# EAGLE design main (EAGLE 5.10)
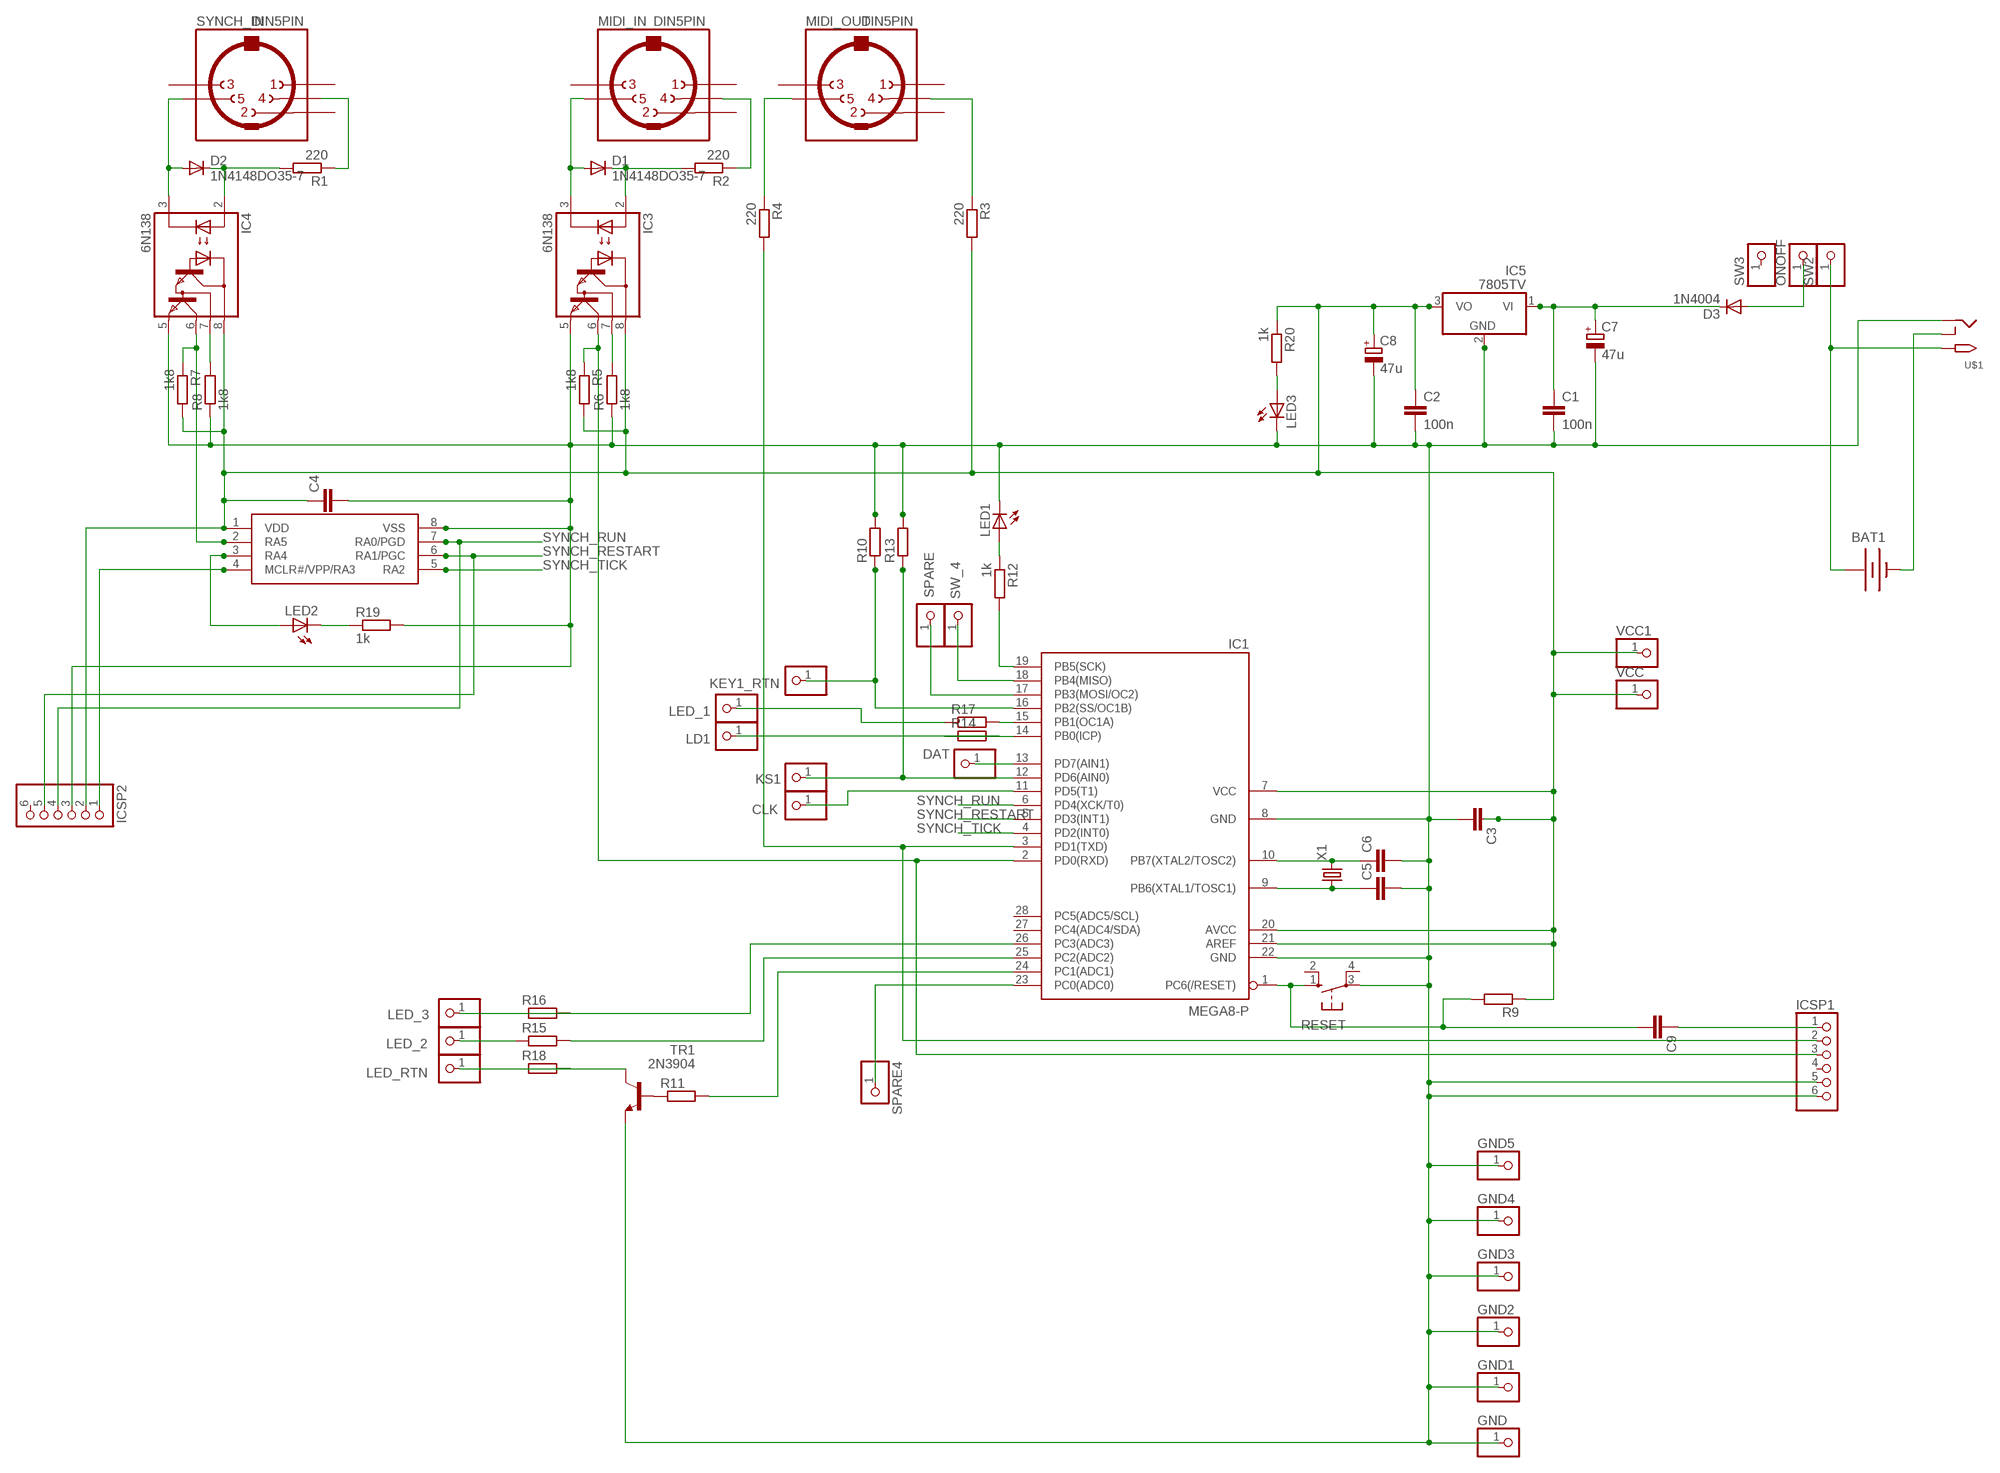
[diagram p0: schematic, sheet 1]

## Parts
BAT1  BATTERY  [PP3_BATTERBOX]
C1  100n  C-EU025-024X044  [C025-024X044]
C2  100n  C-EU025-024X044  [C025-024X044]
C3  C-EU025-024X044  [C025-024X044]
C4  C-EU025-024X044  [C025-024X044]
C5  C-EU025-024X044  [C025-024X044]
C6  C-EU025-024X044  [C025-024X044]
C7  47u  CPOL-EUE2.5-7  [E2,5-7]
C8  47u  CPOL-EUE2.5-7  [E2,5-7]
C9  C-EU025-024X044  [C025-024X044]
CLK  PINHD-1X1  [1X01]
D1  1N4148DO35-7  [DO35-7]
D2  1N4148DO35-7  [DO35-7]
D3  1N4004  [DO41-10]
DAT  PINHD-1X1  [1X01]
GND  PINHD-1X1  [1X01]
GND1  PINHD-1X1  [1X01]
GND2  PINHD-1X1  [1X01]
GND3  PINHD-1X1  [1X01]
GND4  PINHD-1X1  [1X01]
GND5  PINHD-1X1  [1X01]
IC1  MEGA8-P  [DIL28-3]
IC2  PIC12F1822  [DIL08]
IC3  6N138  [DIL08]
IC4  6N138  [DIL08]
IC5  7805TV  [TO220V]
ICSP1  PINHD-1X6  [1X06]
ICSP2  PINHD-1X6  [1X06]
KEY1_RTN  PINHD-1X1  [1X01]
KS1  PINHD-1X1  [1X01]
LD1  PINHD-1X1  [1X01]
LED1  LED3MM  [LED3MM]
LED2  LED3MM  [LED3MM]
LED3  LED3MM  [LED3MM]
LED_1  PINHD-1X1  [1X01]
LED_2  PINHD-1X1  [1X01]
LED_3  PINHD-1X1  [1X01]
LED_RTN  PINHD-1X1  [1X01]
MIDI_IN  DIN5PIN  [CHEAPYDIN]
MIDI_OUT  DIN5PIN  [CHEAPYDIN]
ONOFF  PINHD-1X1  [1X01]
R1  220  R-EU_0207/7  [0207/7]
R2  220  R-EU_0207/7  [0207/7]
R3  220  R-EU_0207/7  [0207/7]
R4  220  R-EU_0207/7  [0207/7]
R5  1k8  R-EU_0207/7  [0207/7]
R6  1k8  R-EU_0207/7  [0207/7]
R7  1k8  R-EU_0207/7  [0207/7]
R8  1k8  R-EU_0207/7  [0207/7]
R9  R-EU_0207/7  [0207/7]
R10  R-EU_0207/7  [0207/7]
R11  R-EU_0207/7  [0207/7]
R12  1k  R-EU_0207/7  [0207/7]
R13  R-EU_0207/2V  [0207/2V]
R14  R-EU_0207/2V  [0207/2V]
R15  R-EU_0207/2V  [0207/2V]
R16  R-EU_0207/2V  [0207/2V]
R17  R-EU_0207/2V  [0207/2V]
R18  R-EU_0207/2V  [0207/2V]
R19  1k  R-EU_0207/7  [0207/7]
R20  1k  R-EU_0207/7  [0207/7]
RESET  10-XX  [B3F-10XX]
SPARE  PINHD-1X1  [1X01]
SPARE4  PINHD-1X1  [1X01]
SW2  PINHD-1X1  [1X01]
SW3  PINHD-1X1  [1X01]
SW_4  PINHD-1X1  [1X01]
SYNCH_IN  DIN5PIN  [CHEAPYDIN]
TR1  2N3904  [TO92]
U$1  2.1MMJACKTHM  [PJ-102A]
VCC  PINHD-1X1  [1X01]
VCC1  PINHD-1X1  [1X01]
X1  CRYSTALHC49S  [HC49/S]

## Nets
DAT: DAT.1 IC1.13(PD7(AIN1))
GND: C1.2 C2.2 C3.2 C4.2 C5.2 C6.2 C7.- C8.- GND1.1 GND2.1 GND3.1 GND4.1 GND5.1 GND.1 IC1.8(GND) IC1.22(GND) IC2.8(VSS) IC3.5(GND) IC4.5(GND) IC5.2(GND) ICSP1.5 ICSP1.6 ICSP2.3 LED1.K(C) LED3.K(C) R6.1 R8.1 R10.2 R13.2 R19.2 RESET.3(P) TR1.3(E) U$1.RING
KS1: IC1.12(PD6(AIN0)) KS1.1 R13.1
LD1: LD1.1 R14.2
LD2: LED_2.1 R15.1
LD3: LED_3.1 R16.2
LD4: LED_1.1 R17.1
N$1: D1.A IC3.3(C) MIDI_IN.5
N$2: D1.C IC3.2(A) R2.2
N$3: MIDI_IN.4 R2.1
N$4: D2.A IC4.3(C) SYNCH_IN.5
N$5: D2.C IC4.2(A) R1.2
N$6: R1.1 SYNCH_IN.4
N$7: IC1.2(PD0(RXD)) IC3.6(VO) ICSP1.3 R5.1
N$8: IC3.7(VB) R6.2
N$9: C9.1 ICSP1.1
N$10: IC4.7(VB) R8.2
N$11: MIDI_OUT.5 R4.1
N$12: IC1.3(PD1(TXD)) ICSP1.2 R4.2
N$13: MIDI_OUT.4 R3.1
N$14: R18.1 TR1.1(C)
N$15: IC2.2(RA5) IC4.6(VO) R7.1
N$16: IC2.3(RA4) LED2.A
N$17: CLK.1 IC1.11(PD5(T1))
N$18: IC2.4(MCLR#/VPP/RA3) ICSP2.1
N$19: LED3.A R20.2
N$33: R11.1 TR1.2(B)
N$35: IC1.26(PC3(ADC3)) R16.1
N$36: C6.1 IC1.10(PB7(XTAL2/TOSC2)) X1.2
N$37: C5.1 IC1.9(PB6(XTAL1/TOSC1)) X1.1
N$38: C9.2 IC1.1(PC6(/RESET)) R9.2 RESET.1(S)
N$42: IC1.25(PC2(ADC2)) R15.2
N$43: IC1.24(PC1(ADC1)) R11.2
N$44: IC1.14(PB0(ICP)) R14.1
N$46: IC1.16(PB2(SS/OC1B)) KEY1_RTN.1 R10.1
N$48: IC1.19(PB5(SCK)) R12.2
N$50: LED1.A R12.1
N$52: LED2.K(C) R19.1
N$54: D3.A ONOFF.1
N$55: IC1.15(PB1(OC1A)) R17.2
N$56: BAT1.0V(-) U$1.RING_SW
PWR+: BAT1.9V(+) SW2.1 U$1.TIP
STROBE: LED_RTN.1 R18.2
SW1: IC1.18(PB4(MISO)) SW_4.1
SYNCH_RESTART: IC1.5(PD3(INT1)) IC2.6(RA1/PGC) ICSP2.5
SYNCH_RUN: IC1.6(PD4(XCK/T0)) IC2.7(RA0/PGD) ICSP2.4
SYNCH_TICK: IC1.4(PD2(INT0)) IC2.5(RA2)
UN1: IC1.23(PC0(ADC0)) SPARE4.1
UN2: IC1.17(PB3(MOSI/OC2)) SPARE.1
VCC: C2.1 C3.1 C4.1 C8.+ IC1.7(VCC) IC1.20(AVCC) IC1.21(AREF) IC2.1(VDD) IC3.8(VCC) IC4.8(VCC) IC5.3(VO) ICSP2.2 R3.2 R5.2 R7.2 R9.1 R20.1 VCC1.1 VCC.1
VIN: C1.1 C7.+ D3.C IC5.1(VI)
Unconnected: IC1.27(PC4(ADC4/SDA)) IC1.28(PC5(ADC5/SCL)) ICSP1.4 ICSP2.6 MIDI_IN.1 MIDI_IN.2 MIDI_IN.3 MIDI_OUT.1 MIDI_OUT.2 MIDI_OUT.3 RESET.2(S1) RESET.4(P1) SW3.1 SYNCH_IN.1 SYNCH_IN.2 SYNCH_IN.3

## Library data of the parts
BAT1 = jasons_stuff:BATTERY: Battery Holders Various common sizes : AA, AAA, 20mm coin cell and 12mm coin cell.
C1-C6 C9 = rcl:C-EU: CAPACITOR, European symbol
C7 C8 = rcl:CPOL-EU: POLARIZED CAPACITOR, European symbol
CLK DAT GND GND1-GND5 KEY1_RTN KS1 LD1 LED_1-LED_3 LED_RTN ONOFF SPARE SPARE4 SW2 SW3 SW_4 VCC VCC1 = adafruit:PINHD-1X1: Pin header 1x1 for 0.1" spacing With round pins
D1 D2 = diode:1N4148: DIODE high speed (Philips)
D3 = adafruit:1N4004: DIODE General purpose 1N400x type rectifier (With bigger pads) http://www.ladyada.net/library/pcb/eaglelibrary.html
IC1 = atmel:MEGA8-P: MICROCONTROLLER 8 Kbytes FLASH, 1 kbytes SRAM, 512 bytes EEPROM, USART, 4-channel 10 bit ADC, 2-channel 8 bit ADC Pin compatible with Atmega48, ATMega88, ATMega168 Source: avr.lbr
IC2 = jasons_stuff:PIC12F1822
IC3 IC4 = optocoupler:6N138: MOTOROLA OPTO COUPLER
IC5 = linear:78*: Positive VOLTAGE REGULATOR Source: http://cache.national.com/ds/LM/LM78L05.pdf http://www.fairchildsemi.com/ds/LM/LM7805.pdf
ICSP1 ICSP2 = adafruit:PINHD-1X6: PIN HEADER
LED1-LED3 = adafruit:LED: LED OSRAM: - CHIPLED LG R971, LG N971, LY N971, LG Q971, LY Q971, LO R971, LY R971 LH N974, LH R974 LS Q976, LO Q976, LY Q976 LO Q996 - Hyper CHIPLED LW Q18S LB Q993, LB Q99A, LB R99A - SideLED LS A670, LO A670, LY A670, LG A670, LP A670 LB A673, LV A673, LT A673, LW A673 LH A674 LY A675 LS A676, LA A676, LO A676, LY A676, LW A676 LS A679, LY A679, LG A679 - Hyper Micro SIDELED® LS Y876, LA Y876, LO Y876, LY Y876 LT Y87S - SmartLED LW L88C, LW L88S LB L89C, LB L89S, LG L890 LS L89K, LO L89K, LY L89K LS L896, LA L896, LO L896, LY L896 - TOPLED LS T670, LO T670, LY T670, LG T670, LP T670 LSG T670, LSP T670, LSY T670, LOP T670, LYG T670 LG T671, LOG T671, LSG T671 LB T673, LV T673, LT T673, LW T673 LH T674 LS T676, LA T676, LO T676, LY T676, LB T676, LH T676, LSB T676, LW T676 LB T67C, LV T67C, LT T67C, LS T67K, LO T67K, LY T67K, LW E67C LS E67B, LA E67B, LO E67B, LY E67B, LB E67C, LV E67C, LT E67C LW T67C LS T679, LY T679, LG T679 LS T770, LO T770, LY T770, LG T770, LP T770 LB T773, LV T773, LT T773, LW T773 LH T774 LS E675, LA E675, LY E675, LS T675 LS T776, LA T776, LO T776, LY T776, LB T776 LHGB T686 LT T68C, LB T68C - Hyper Mini TOPLED® LB M676 - Mini TOPLED Santana® LG M470 LS M47K, LO M47K, LY M47K Source: http://www.osram.convergy.de/
MIDI_IN MIDI_OUT SYNCH_IN = jasons_stuff:DIN5PIN: Female CONNECTOR 5 pins 90 deg. with shield, horizontal (DIN 41524)
R1-R20 = rcl:R-EU_: RESISTOR, European symbol
RESET = switch-omron:10-XX: OMRON SWITCH
TR1 = transistor:2N3904: NPN TRANSISTOR
U$1 = adafruit:2.1MMJACK: 2.1mm x 5.5mm THM DC jack with internal switch. Digikey part #PJ-102A, 4UCON part #05537 2.1mm x 5.5mm SMT DC jack with internal switch. Digikey part #PJ-002A-SMT, 4UCON part #03267 By microbuilder.eu & adafruit.com
X1 = crystal:CRYSTAL: CRYSTAL

## Board
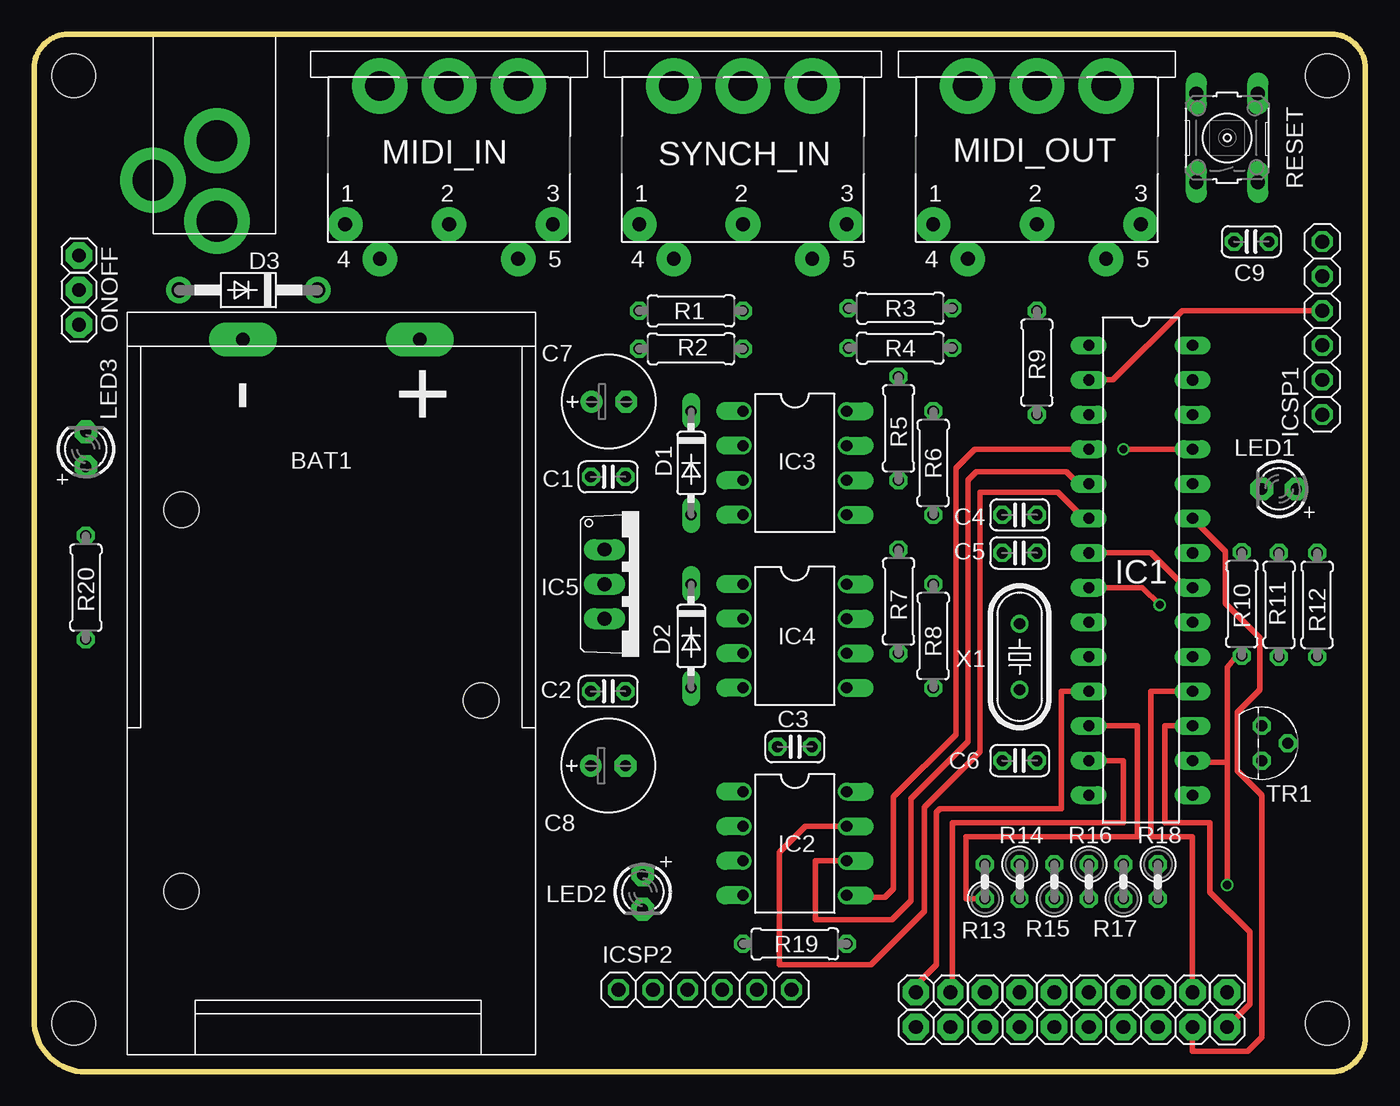
[diagram p1: board, top side]
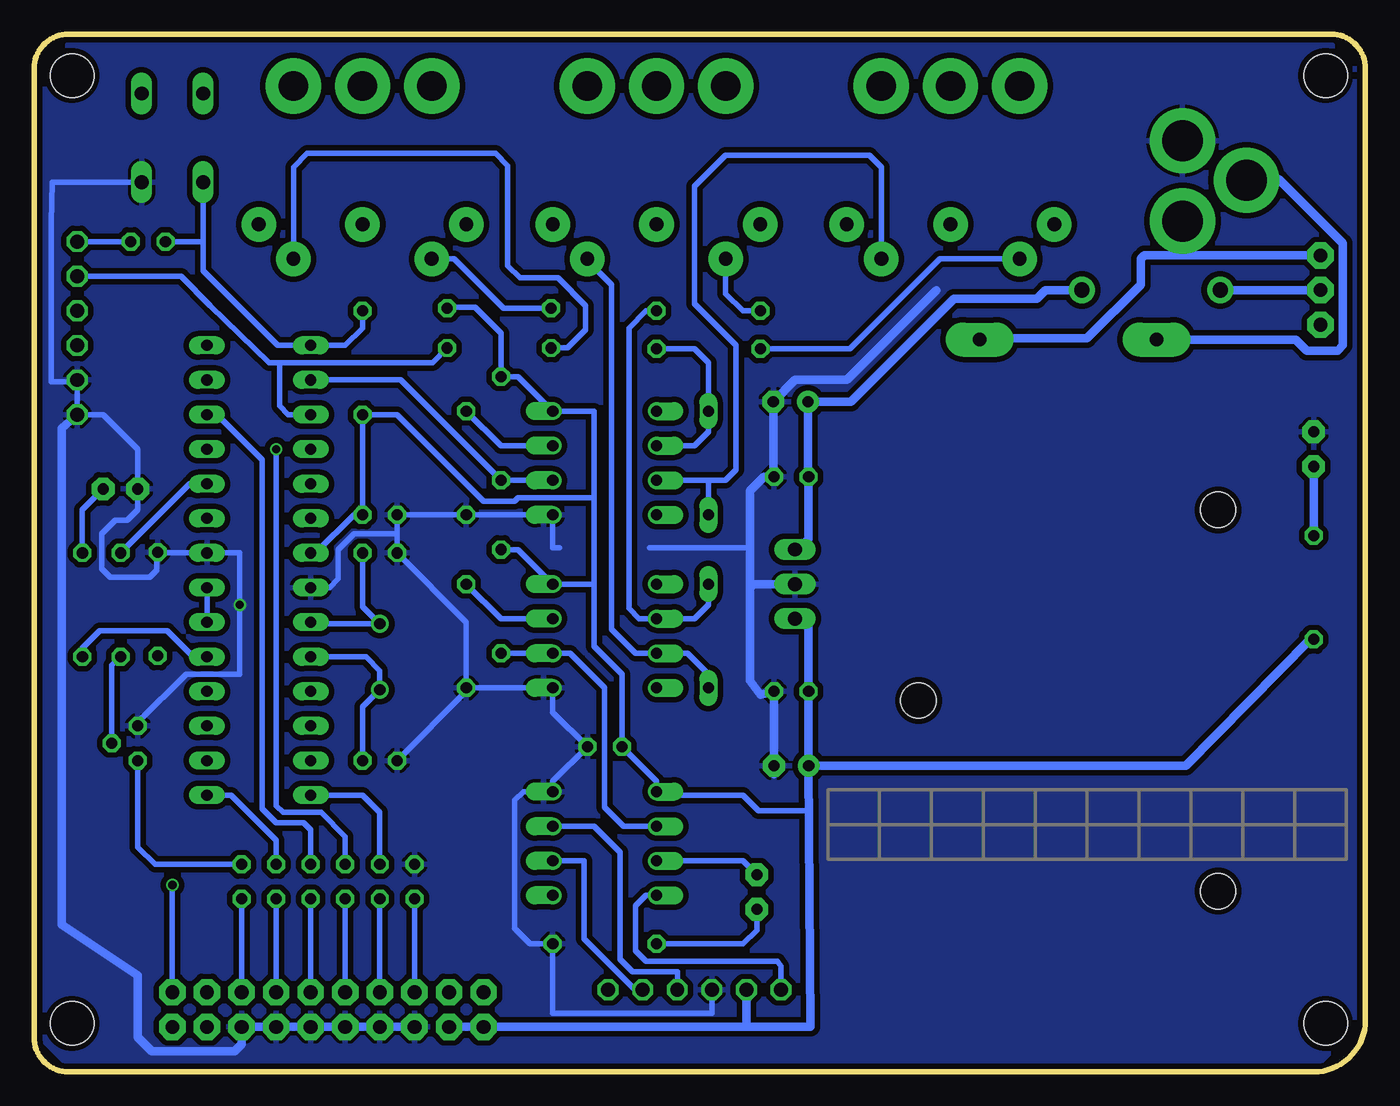
[diagram p2: board, bottom side, seen from below]

Size 97.79 x 76.2 mm. Coordinates in mm from the lower left corner, seen from the top.
Outline: 0,73.66 arc-90 2.54,76.2 95.25,76.2 arc-90 97.79,73.66 97.79,2.54 arc-90 95.25,0 3.81,0 arc-90 0,3.81 0,73.66
Copper layers (1*16): Top 0.035mm / dielectric 1.5mm / Bottom 0.035mm
Design rules "ITEADstudio_DRC": minimum track width 6mil, minimum drill 12mil, track to track 6mil, track to pad 6mil, pad to pad 6mil, via to via 6mil, smd to smd 0mil, copper to edge 10mil, drill to drill 10mil, minimum pad ring 10mil, minimum via ring 6mil, stop-mask expansion 2mil, vias tented up to drill 100mil, thermal gap 10mil
Holes 3.2 mm at 2.92,73.15 2.92,3.56 95,73.15 95,3.56

### Footprints (pad centres in the part's own frame; a part is rotated, then mirrored left to right if it is on the bottom)
PP3_BATTERBOX = drill 1 pad 2.5 long: 0V 52.5,21.5; 9V 52.5,8.5 | hole 2.6: 12,26; 40,26; 26,4
C025-024X044 = drill 0.813 octagon: 1 -1.27,0; 2 1.27,0
E2,5-7 = drill 0.813 pad 1.6 round: + -1.27,0 | drill 0.813 pad 1.6 octagon: - 1.27,0
1X01 = drill 1.016 pad 1.93 octagon: 1 0,0
DO35-7 = drill 0.813 long: A 3.81,0; C -3.81,0
DO41-10 = drill 1.118 pad 1.93 round: A 5.08,0; C -5.08,0
DIL28-3 = drill 0.813 long: 1 -16.51,-3.81; 2 -13.97,-3.81; 3 -11.43,-3.81; 4 -8.89,-3.81; 5 -6.35,-3.81; 6 -3.81,-3.81; 7 -1.27,-3.81; 8 1.27,-3.81; 9 3.81,-3.81; 10 6.35,-3.81; 11 8.89,-3.81; 12 11.43,-3.81; 13 13.97,-3.81; 14 16.51,-3.81; 15 16.51,3.81; 16 13.97,3.81; 17 11.43,3.81; 18 8.89,3.81; 19 6.35,3.81; 20 3.81,3.81; 21 1.27,3.81; 22 -1.27,3.81; 23 -3.81,3.81; 24 -6.35,3.81; 25 -8.89,3.81; 26 -11.43,3.81; 27 -13.97,3.81; 28 -16.51,3.81
DIL08 = drill 0.813 offset: 1 -3.81,-3.81; 2 -1.27,-3.81; 3 1.27,-3.81; 4 3.81,-3.81; 5 3.81,3.81; 6 1.27,3.81; 7 -1.27,3.81; 8 -3.81,3.81
TO220V = drill 1.016 long: 1 -2.54,-2.54; 2 0,-2.54; 3 2.54,-2.54
1X06 = drill 1.016 octagon: 1 -6.35,0; 2 -3.81,0; 3 -1.27,0; 4 1.27,0; 5 3.81,0; 6 6.35,0
LED3MM = drill 0.813 pad 1.676 octagon: A -1.27,0; K 1.27,0
CHEAPYDIN = drill 1.016 pad 2.54 round: 1 7.62,5.08; 2 0,5.08; 3 -7.62,5.08; 4 5.08,7.62; 5 -5.08,7.62 | drill 2.159 pad 4.064 round: NC -5.08,-5.08; NC1 0,-5.08; NC2 5.08,-5.08
0207/7 = drill 0.813 octagon: 1 -3.81,0; 2 3.81,0
0207/2V = drill 0.813 octagon: 1 -1.27,0; 2 1.27,0
B3F-10XX = drill 1.016 long: 1 -3.251,2.261; 2 3.251,2.261; 3 -3.251,-2.261; 4 3.251,-2.261
TO92 = drill 0.813 octagon: 1 1.27,0; 2 0,1.905; 3 -1.27,0
PJ-102A = drill 3 pad 4.8 round: RING 0.1,-3.39; RING_SW -4.6,-6.29; TIP 0.1,-9.29
HC49/S = drill 0.813 round: 1 -2.413,0; 2 2.413,0

### Placement (x,y rotation side)
BAT1  36.83,1.27 90 top
C1  42.16,43.69 0 top
C2  42.16,27.94 0 top
C3  55.88,23.88 0 top
C4  72.39,40.89 180 top
C5  72.39,38.1 180 top
C6  72.39,22.86 180 top
C7  42.23,49.21 0 top
C8  42.16,22.48 0 top
C9  89.41,60.96 180 top
CLK  64.77,5.84 0 top
D1  48.26,44.7 270 top
D2  48.26,32 270 top
D3  15.75,57.4 180 top
DAT  67.31,5.84 0 top
GND  80.01,3.3 0 top
GND1  82.55,3.3 0 top
GND2  72.39,3.3 0 top
GND3  74.93,3.3 0 top
GND4  77.47,3.3 0 top
GND5  69.85,3.3 0 top
IC1  81.28,36.83 270 top
IC2  55.88,16.76 270 top
IC3  55.88,44.7 270 top
IC4  55.88,32 270 top
IC5  44.45,35.81 270 top
ICSP1  94.61,54.61 270 top
ICSP2  49.28,6.03 0 top
KEY1_RTN  87.63,5.84 90 top
KS1  69.85,5.84 90 top
LD1  72.39,5.84 90 top
LED1  91.44,42.8 180 top
LED2  44.7,13.21 270 top
LED3  3.81,45.72 90 top
LED_1  80.01,5.84 90 top
LED_2  74.93,5.84 90 top
LED_3  77.47,5.84 90 top
LED_RTN  82.55,5.84 90 top
MIDI_IN  30.48,67.31 180 top
MIDI_OUT  73.66,67.31 180 top
ONOFF  3.3,57.4 0 top
R1  48.26,55.88 0 top
R2  48.26,53.09 0 top
R3  63.63,56.07 0 top
R4  63.63,53.15 0 top
R5  63.5,47.24 90 top
R6  66.04,44.7 90 top
R7  63.5,34.54 90 top
R8  66.04,32 90 top
R9  73.66,52.07 90 top
R10  88.71,34.35 90 top
R11  91.44,34.29 90 top
R12  94.23,34.29 270 top
R13  69.85,13.97 90 top
R14  72.39,13.97 270 top
R15  74.93,13.97 90 top
R16  77.47,13.97 270 top
R17  80.01,13.97 90 top
R18  82.55,13.97 270 top
R19  55.88,9.4 0 top
R20  3.81,35.56 90 top
RESET  87.63,68.58 90 top
SPARE  87.63,3.3 90 top
SPARE4  85.09,3.3 0 top
SW2  3.3,59.94 0 top
SW3  3.3,54.86 0 top
SW_4  85.09,5.84 90 top
SYNCH_IN  52.07,67.31 180 top
TR1  90.17,24.13 270 top
U$1  13.33,71.76 0 top
VCC  64.77,3.3 0 top
VCC1  67.31,3.3 0 top
X1  72.39,30.48 270 top

### Tracks (layer width: path | path; a pad name or v marks a point on that pad's centre or on a via)
DAT
  Top 0.406: DAT.1 67.44,5.97 67.44,18.29 80.01,18.29 80.01,22.86 IC1.13
GND  (via drill 0.6)
  Top 0.406: IC1.8 81.41,35.56 v82.68,34.29
  Bottom 0.406: R8.1 IC4.5 59.69,26.42 C3.2 59.69,21.34 IC2.8 61.85,20.57 62.48,19.94 62.48,10.54 61.34,9.4 R19.2 59.69,4.32 48.01,4.32 ICSP2.3 | 71.12,39.37 C5.2 66.04,33.02 R8.1 | 71.12,39.37 C4.2 R6.1 IC3.5 59.69,38.48 59.18,38.48 | R8.1 66.04,27.94 C6.2 | IC1.8 76.07,35.56 75.44,36.2 75.44,38.35 74.3,39.5 71.25,39.5 71.12,39.37 | RESET.3 96.47,65.33 96.52,62.36 96.52,50.67 94.74,50.67 ICSP1.5 ICSP1.6 92.71,48.26 90.17,45.72 LED1.K 90.17,41.27 90.93,40.51 91.82,40.51 92.84,39.5 92.84,36.96 92.2,36.32 89.28,36.32 88.77,36.83 88.77,38.1 R10.2 88.65,38.1 IC1.22 82.68,38.1 v82.68,34.29 82.68,29.21 86.61,29.21 90.17,25.65 | 45.21,28.7 45.21,38.48 52.58,38.48
  Bottom 0.61: 13.43,68.1 U$1.RING 13.33,68.27 13.33,67.82 | 45.21,35.56 45.21,28.7 44.45,27.69 C2.2 C8.- 43.43,21.84 | 45.21,35.56 45.21,38.48 45.21,42.67 44.2,43.69 C1.2 43.5,43.75 C7.- 41.91,50.8 38.1,50.8 31.5,57.4 | IC5.2 44.96,35.81 45.21,35.56 | GND2.1 GND3.1 GND4.1 GND.1 | ICSP1.6 95.76,47.24 95.76,10.8 90.17,7.11 90.17,2.54 89.15,1.52 83.06,1.52 82.55,2.03 GND1.1 GND2.1 | GND2.1 GND5.1
  pour Bottom (isolate 0.406): 0.51,3.56 0.51,73.15 0.51,73.41 2.79,75.69 95,75.69 97.41,73.28 97.41,3.56 97.41,2.67 95.12,0.38 3.68,0.38
KS1
  Top 0.406: IC1.12 81.03,25.4 81.03,17.27 68.45,17.27 68.45,12.7 R13.1
  Bottom 0.406: KS1.1 R13.1
LD1
  Bottom 0.406: LD1.1 R14.2
LD2
  Bottom 0.406: LED_2.1 R15.1
LD3
  Bottom 0.406: LED_3.1 R16.2
LD4
  Bottom 0.406: LED_1.1 R17.1
N$1
  Bottom 0.406: MIDI_IN.5 35.56,66.42 36.45,67.31 46.99,67.31 49.28,65.02 49.28,56.39 46.23,53.34 46.23,44.2 46.99,43.43 48.26,43.43 | 48.26,43.43 IC3.3 | D1.A 48.26,43.43
N$2
  Bottom 0.406: IC3.2 49.28,45.97 48.26,46.99 D1.C 48.26,52.07 49.28,53.09 R2.2
N$3
  Bottom 0.406: MIDI_IN.4 31.24,59.69 37.85,53.09 R2.1
N$4
  Bottom 0.406: SYNCH_IN.5 57.15,59.56 55.37,57.78 55.37,32.51 53.59,30.73 IC4.3 49.78,30.73 48.26,29.21 D2.A
N$5
  Bottom 0.406: D2.C 48.26,34.29 49.28,33.27 IC4.2 53.34,33.27 54.1,34.04 54.1,54.61 52.83,55.88 R1.2
N$6
  Bottom 0.406: SYNCH_IN.4 46.99,57.15 45.72,55.88 R1.1
N$7
  Top 0.406: ICSP1.3 84.33,55.88 79.25,50.8 IC1.2
  Bottom 0.406: IC3.6 R5.1 70.87,50.8 IC1.2
N$8
  Bottom 0.406: IC3.7 63.5,45.97 R6.2
N$9
  Bottom 0.406: C9.1 ICSP1.1
N$10
  Bottom 0.406: IC4.7 63.5,33.27 R8.2
N$11
  Bottom 0.406: MIDI_OUT.5 78.74,66.42 77.72,67.44 63.88,67.44 62.99,66.55 62.99,59.18 62.1,58.29 59.31,58.29 57.28,56.26 57.28,54.48 58.61,53.15 R4.1
N$12
  Bottom 0.406: 79.76,52.07 79.76,48.89 79.12,48.26 IC1.3 | 79.76,52.07 80.52,52.07 84.84,56.26 86.99,58.42 ICSP1.2 | 79.76,52.07 68.52,52.07 R4.2
N$13
  Bottom 0.406: R3.1 63.31,56.07 66.93,59.69 MIDI_OUT.4
N$14
  Bottom 0.406: R18.1 88.9,15.24 90.17,16.51 TR1.1
N$15
  Bottom 0.406: R7.1 IC4.6 58.42,30.73 55.88,28.19 55.88,19.43 54.48,18.03 IC2.2
N$16
  Bottom 0.406: IC2.3 45.72,15.49 LED2.A
N$17
  Top 0.406: IC1.11 75.44,27.94 75.44,19.3 66.55,19.3 66.29,19.05 66.29,7.87 64.77,6.35 CLK.1
N$18
  Bottom 0.406: IC2.4 52.83,12.95 53.59,12.19 53.59,8.89 52.83,8.13 43.18,8.13 42.93,7.75 ICSP2.1 42.93,6.35
N$19
  Bottom 0.61: R20.2 LED3.A
N$33
  Bottom 0.406: TR1.2 92.08,29.84 R11.1
N$35
  Bottom 0.406: IC1.26 84.33,48.26 81.03,44.96 81.03,19.3 80.01,18.29 77.98,18.29 77.47,17.78 R16.1
N$36
  Bottom 0.406: C6.1 73.66,26.8 X1.2 72.39,29.46 73.41,30.48 IC1.10
N$37
  Bottom 0.406: C5.1 73.66,34.16 X1.1 77.34,32.89 IC1.9
N$38
  Bottom 0.406: 85.37,60.96 85.37,58.83 79.88,53.34 IC1.1 74.93,53.34 73.66,54.61 R9.2 | 85.37,60.96 RESET.1 | 85.37,60.96 C9.2
N$42  (via drill 0.6)
  Top 0.406: v80.01,45.72 IC1.25
  Bottom 0.406: R15.2 74.93,17.27 76.71,19.05 79.5,19.05 80.01,19.56 v80.01,45.72
N$43
  Bottom 0.406: IC1.24 86.36,43.18 R11.2
N$44
  Bottom 0.406: IC1.14 73.66,20.32 72.39,19.05 R14.1
N$46  (via drill 0.6)
  Top 0.406: R10.1 88.33,30.54 87.63,29.72 87.63,24.26 87.63,22.73 | 87.63,22.73 85.22,22.73 IC1.16 | 87.63,13.86 v87.63,13.72 87.63,22.73
  Bottom 0.406: KEY1_RTN.1 v87.63,13.72
N$48
  Bottom 0.406: IC1.19 86.11,30.48 88.01,32.38 92.96,32.38 94.23,31.11 R12.2
N$50
  Bottom 0.406: R12.1 94.23,41.27 LED1.A
N$52
  Bottom 0.406: R19.1 45.72,9.4 44.7,10.41 LED2.K
N$54
  Bottom 0.61: ONOFF.1 D3.A
N$55
  Bottom 0.406: R17.2 80.01,17.02 83.31,20.32 IC1.15
N$56
  Bottom 0.61: BAT1.0V 5.13,53.77 4.32,52.96 2.03,52.96 1.65,53.34 1.65,60.83 6.35,65.53 8.67,65.53 U$1.RING_SW
PWR+
  Bottom 0.61: BAT1.9V 28.25,53.85 20.45,53.85 16.51,57.78 16.51,59.69 16.26,59.94 13.46,59.94 | SW2.1 13.46,59.94 | U$1.TIP 13.43,59.97 13.46,59.94
STROBE
  Bottom 0.406: LED_RTN.1 R18.2
SW1
  Top 0.406: IC1.18 82.04,27.94 82.04,17.27 85.09,17.27 SW_4.1
SYNCH_RESTART
  Top 0.406: IC2.6 57.4,15.49 57.4,11.18 62.99,11.18 64.39,12.57 64.39,20.07 68.58,24.26 68.58,43.43 69.21,44.07 75.82,44.07 76.71,43.18 IC1.5
  Bottom 0.406: ICSP2.5 53.66,6.03 57.4,9.78 57.4,15.49 IC2.6
SYNCH_RUN
  Top 0.406: IC1.6 77.09,40.64 75.18,42.55 69.47,42.55 69.47,23.49 65.41,19.43 65.41,11.81 61.47,7.87 54.74,7.87 54.74,16.13 56.64,18.03 IC2.7
  Bottom 0.406: IC2.7 56.64,18.03 54.74,16.13 54.74,8.25 53.85,7.37 50.55,7.37 ICSP2.4
SYNCH_TICK
  Top 0.406: IC2.5 59.82,12.83 62.48,12.83 63.12,13.46 63.12,20.19 67.69,24.77 67.69,44.32 69.09,45.72 IC1.4
UN1
  Top 0.406: SPARE4.1 85.09,1.52 89.15,1.52 90.17,2.54 90.17,20.32 88.39,22.1 88.39,26.42 90.04,28.07 90.04,31.88 87.5,34.42 87.5,38.23 IC1.23
UN2
  Top 0.406: SPARE.1 89.28,4.95 89.28,10.29 86.36,13.21 86.36,18.29 83.06,18.29 83.06,25.4 IC1.17
VCC
  Top 0.406: IC1.7 82.04,38.1 84.58,35.56 IC1.21
  Bottom 0.406: R7.2 62.23,38.35 IC4.8 56.64,35.81 | IC1.7 77.09,38.1 74.3,40.89 C4.1 R9.1 71.12,48.26 64.77,41.91 62.48,41.91 62.23,42.16 56.64,42.16 | 56.64,35.81 56.64,31.24 54.61,29.21 C3.1 52.07,21.34 IC2.1 52.07,20.32 45.72,20.32 44.58,19.18 41.02,19.18 | 56.64,35.81 56.64,42.16 | IC1.21 IC1.20 | 56.64,42.16 56.64,48.51 IC3.8 62.23,51.05 R5.2 63.5,54.23 65.41,56.13 67.37,56.13 R3.2 | 41.02,19.18 40.77,18.92 | C8.+ 40.77,19.43 41.02,19.18
  Bottom 0.61: IC5.3 41.4,33.27 40.89,32.77 C2.1 C8.+ | C8.+ 40.89,21.84 | C8.+ 40.77,3.3 45.47,3.3 | 45.47,3.3 VCC.1 VCC1.1 | 45.47,3.3 ICSP2.2 | R20.1 4.06,31.75 13.21,22.48 C8.+
VIN
  Bottom 0.61: IC5.1 41.91,38.1 40.89,39.12 C1.1 40.96,43.75 C7.+ 37.78,49.21 30.23,56.77 24.13,56.77 23.5,57.4 D3.C

### Text on the board
tDocu: 1 | 1
bDocu: arpie | arpie | midi sequencer | main board | rev 1 | hotchk155 | CLK | DAT | KS1 | LD1 | LD2 | LD3 | LD4 | STR | SW1 | KS2 | VCC | VCC | GND | GND | GND | GND | GND | GND | UN1 | UN2